# Altium schematic sheet SparkaAway.SchDoc
size A4
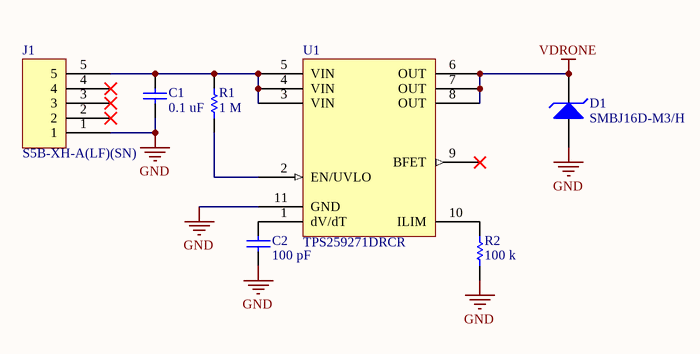
[diagram p0: SparkaAway.SchDoc]

## Parts
C1  0.1 uF  [CAPC1608X10L]
C2  100 pF  [CAPC1608X10L]
D1  SMBJ16D-M3/H  [DO-214AA SMB DIOM4336X24N]
J1  S5B-XH-A(LF)(SN)  [S5B-XH-A(LF)(SN)]
R1  1 M  [RESC1608X05N]
R2  100 k  [RESC1608X05N]
U1  TPS259271DRCR  [TI S-PVSON-N10 SON50P300X100_HS-11N]

## Nets
GND: C1.1 C2.1 D1.2(A) J1.1 R2.1 U1.11(GND)
VDRONE: D1.1(K) U1.6(OUT) U1.7(OUT) U1.8(OUT)
NetC1_2: C1.2 J1.5 R1.2 U1.3(VIN) U1.4(VIN) U1.5(VIN)
NetC2_2: C2.2 U1.1(dV/dT)
NetR1_1: R1.1 U1.2(EN/UVLO)
NetR2_2: R2.2 U1.10(ILIM)

Not connected (* = marked no-connect by the designer): J1 2* 3* 4*; U1 9(BFET)*

## Library data of the parts
C1 = CL10B104MB8NNNC: CAP CER 0.1UF 50V X7R 0603; Manufacturer: Samsung Electro-Mechanics America, Inc.; Capacitance: 0.10µF; Tolerance: ±20%; Supplier 1: Digi-Key; Manufacturer Part Number: CL10B104MB8NNNC; RoHS: RoHS Compliant; Category: Capacitors; Stock 1: 64597; Pricing 1: 1=0.1, 10=0.023, 25=0.0168, 50=0.0126, 100=0.0104, 250=0.00868, 500=0.0074, 1000=0.00581 (EUR); Packaging: Cut Tape (CT); Part Status: Active; Voltage - Rated: 50V; Temperature Coefficient: X7R; Operating Temperature: -55°C ~ 125°C; Features: -; Ratings: -; Applications: General Purpose; Mounting Type: Surface Mount, MLCC; Package / Case: 0603 (1608 Metric); Size / Dimension: 0.063" L x 0.031" W (1.60mm x 0.80mm); Height - Seated (Max): -; Thickness (Max): 0.035" (0.90mm); Lead Spacing: -; Lead Style: -; ComponentLink1URL: http://www.samsungsem.com/kr/support/product-search/mlcc/__icsFiles/afieldfile/2016/08/18/S_CL10B104MB8NNNC.pdf; ComponentLink1Description: http://www.samsungsem.com/kr/support/product-search/mlcc/__icsFiles/afieldfile/2016/08/18/S_CL10B104MB8NNNC.pdf; Supplier Part Number 1: 1276-1941-1-ND
C2 = CGA3E2C0G1H101J080AA: Multilayer Ceramic Capacitors MLCC - SMD/SMT 0603 100pF 50volts C0G 5% T=0.8mm; Manufacturer: TDK; Type: Automotive Multilayer Ceramic Chip Capacitor; Voltage Rating DC: 50 VDC; Dielectric: C0G (NP0); Supplier 1: Mouser; Manufacturer Part Number: CGA3E2C0G1H101J080AA; RoHS: RoHS Compliant; Category: Multilayer Ceramic Capacitors MLCC - SMD/SMT; Stock 1: 27800; Pricing 1: 1=0.091, 10=0.049, 100=0.016, 1000=0.013, 4000=0.010, 8000=0.008, 48000=0.007 (EUR); Capacitance: 100 pF; Height: 0.8 mm; Length: 1.6 mm; Package/Case: 0603 (1608 metric); Packaging: Reel; Product: Automotive MLCCs; Series: CGA; Termination Style: SMD/SMT; Tolerance: 5 %; Width: 0.8 mm; Brand: TDK; Case Code - in: 0603; Case Code - mm: 1608; Maximum Operating Temperature: + 125 C; Minimum Operating Temperature: - 55 C; Standard Pack Qty: 4000; RoHS - Mouser: Y; Minimum Order Quantity: 1; Reeling: True; ComponentLink1URL: http://www.mouser.com/ds/2/400/mlcc_automotive_general_en-269806.pdf; ComponentLink1Description: http://www.mouser.com/ds/2/400/mlcc_automotive_general_en-269806.pdf; Supplier Part Number 1: 810-CGA3E2C0G1H101J
D1 = SMBJ16D-M3/H: TVS DIODE 16VWM 25.6VC DO214AA; Manufacturer: Vishay Semiconductor Diodes Division; Type: Zener; Unidirectional Channels: 1; Voltage - Reverse Standoff (Typ): 16V; Voltage - Breakdown (Min): 18.1V; Voltage - Clamping (Max) @ Ipp: 25.6V; Current - Peak Pulse (10/1000µs): 23.4A; Power - Peak Pulse: 600W; Power Line Protection: No; Supplier 1: Digi-Key; Manufacturer Part Number: SMBJ16D-M3/H; RoHS: RoHS Compliant; Category: Circuit Protection; Stock 1: 7542; Pricing 1: 1=0.34, 10=0.275, 25=0.2508, 100=0.1867, 250=0.16916 (EUR); Packaging: Cut Tape (CT); Part Status: Active; Bidirectional Channels: -; Applications: General Purpose; Capacitance @ Frequency: -; Operating Temperature: -55°C ~ 150°C (TJ); Mounting Type: Surface Mount; Package / Case: DO-214AA, SMB; Supplier Device Package: DO-214AA (SMBJ); ComponentLink1URL: http://www.vishay.com/docs/87606/87606.pdf; ComponentLink1Description: http://www.vishay.com/docs/87606/87606.pdf; Supplier Part Number 1: SMBJ16D-M3/HGICT-ND
J1 = S5B-XH-A(LF)(SN): CONN HEADER XH SIDE 5POS 2.5MM; Manufacturer: JST Sales America Inc.; Connector Type: Header, Shrouded; Number of Positions: 5; Number of Positions Loaded: All; Pitch: 0.098" (2.50mm); Supplier 1: Digi-Key; Manufacturer Part Number: S5B-XH-A(LF)(SN); RoHS: RoHS Compliant; Category: Connectors, Interconnects; Stock 1: 38810; Pricing 1: 1=0.29, 10=0.276, 100=0.1936, 500=0.16594, 1000=0.13827, 5000=0.11852, 10000=0.11062 (EUR); Packaging: Bulk; Part Status: Active; Contact Type: Male Pin; Number of Rows: 1; Row Spacing: -; Contact Mating Length: -; Mounting Type: Through Hole, Right Angle; Termination: Press-Fit; Fastening Type: Detent Lock; Features: -; Contact Finish: Tin; Contact Finish Thickness: -; Color: Natural; ComponentLink1URL: http://www.jst-mfg.com/product/pdf/eng/eXH.pdf; ComponentLink1Description: http://www.jst-mfg.com/product/pdf/eng/eXH.pdf; Supplier Part Number 1: 455-2242-ND
R1 = CRCW06031M00FKEA: Thick Film Resistors - SMD 1/10watt 1.0Mohms 1%; Manufacturer: Vishay / Dale; Power Rating: 100 mW; Resistance: 1 MOhms; Temperature Coefficient: 100 PPM / K; Voltage Rating: 75 V; Supplier 1: Mouser; Manufacturer Part Number: CRCW06031M00FKEA; RoHS: RoHS Compliant By Exemption; Category: Thick Film Resistors - SMD; Stock 1: 156208; Pricing 1: 1=0.091, 10=0.040, 100=0.024, 500=0.019, 1000=0.016, 5000=0.005, 50000=0.004 (EUR); Height: 0.45 mm; Length: 1.55 mm; Operating Temperature Range: - 55 C to + 155 C; Package/Case: 0603 (1608 metric); Packaging: Reel; Product: Thick Film Resistors SMD; Series: CRCW; Termination Style: SMD/SMT; Tolerance: 1 %; Width: 0.85 mm; Brand: Vishay / Dale; Case Code - in: 0603; Case Code - mm: 1608; Product Category: 0603 Thick Film Chip Resistors; Standard Pack Qty: 5000; RoHS - Mouser: E; Minimum Order Quantity: 1; Reeling: True; ComponentLink1URL: http://www.mouser.com/ds/2/427/dcrcwe3-109170.pdf; ComponentLink1Description: http://www.mouser.com/ds/2/427/dcrcwe3-109170.pdf; Supplier Part Number 1: 71-CRCW0603-1.0M-E3
R2 = CRCW0603100KFKEA: Thick Film Resistors - SMD 1/10watt 100Kohms 1%; Manufacturer: Vishay / Dale; Power Rating: 100 mW; Temperature Coefficient: 100 PPM / K; Voltage Rating: 75 V; Supplier 1: Mouser; Manufacturer Part Number: CRCW0603100KFKEA; RoHS: RoHS Compliant By Exemption; Category: Thick Film Resistors - SMD; Stock 1: 395641; Pricing 1: 1=0.091, 10=0.040, 100=0.024, 500=0.019, 1000=0.016, 5000=0.005, 50000=0.004 (EUR); Height: 0.45 mm; Length: 1.55 mm; Operating Temperature Range: - 55 C to + 155 C; Package/Case: 0603 (1608 metric); Packaging: Reel; Product: Thick Film Resistors SMD; Resistance: 100 kOhms; Series: CRCW; Termination Style: SMD/SMT; Tolerance: 1 %; Width: 0.85 mm; Brand: Vishay / Dale; Case Code - in: 0603; Case Code - mm: 1608; Product Category: 0603 Thick Film Chip Resistors; Standard Pack Qty: 5000; RoHS - Mouser: E; Minimum Order Quantity: 1; Reeling: True; ComponentLink1URL: http://www.mouser.com/ds/2/427/dcrcwe3-109170.pdf; ComponentLink1Description: http://www.mouser.com/ds/2/427/dcrcwe3-109170.pdf; Supplier Part Number 1: 71-CRCW0603-100K-E3
U1 = TPS259271DRCR: IC EFUSE 18V BFET DVR 5A 10VSON; Manufacturer: Texas Instruments; Number of Channels: 1; Internal Switch(s): Yes; Programmable Features: Current Limit, Slew Rate, UVLO; Voltage - Supply: 4.5 V ~ 18 V; Current - Supply: 420µA; Feature Pins: EN; Supplier 1: Digi-Key; Manufacturer Part Number: TPS259271DRCR; RoHS: RoHS Compliant; Category: Integrated Circuits (ICs); Stock 1: 466; Pricing 1: 1=1.61, 10=1.444, 100=1.126, 500=0.9312, 1000=0.59388 (EUR); Packaging: Cut Tape (CT); Part Status: Active; Type: Hot Swap Controller; Applications: General Purpose; Features: Auto Retry, OVP, Thermal Limit; Current - Output (Max): 5A; Operating Temperature: -40°C ~ 85°C; Mounting Type: Surface Mount; Package / Case: 10-VFDFN Exposed Pad; Supplier Device Package: 10-VSON (3x3); ComponentLink1URL: http://www.ti.com/lit/ds/symlink/tps25927.pdf; ComponentLink1Description: http://www.ti.com/lit/ds/symlink/tps25927.pdf; Supplier Part Number 1: 296-44973-1-ND